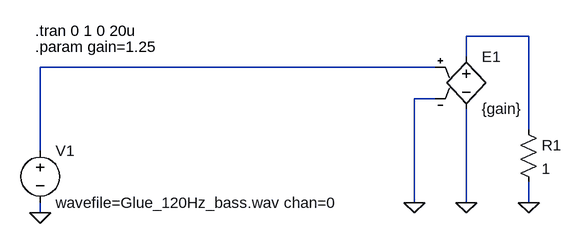
[diagram p0: schematic WaveFile_exam.asc]
WaveFile_exam.asc, the LTspice schematic file:
Version 4
SHEET 1 880 680
WIRE 736 -64 640 -64
WIRE 640 -32 640 -64
WIRE 592 -16 -16 -16
WIRE 592 32 560 32
WIRE 736 80 736 -64
WIRE -16 112 -16 -16
WIRE 560 192 560 32
WIRE 640 192 640 48
WIRE 736 192 736 160
WIRE -16 208 -16 192
FLAG -16 208 0
FLAG 560 192 0
FLAG 736 192 0
FLAG 640 192 0
SYMBOL voltage -16 96 R0
WINDOW 123 0 0 Left 0
WINDOW 39 0 0 Left 0
SYMATTR InstName V1
SYMATTR Value wavefile=Glue_120Hz_bass.wav chan=0
SYMBOL res 720 64 R0
SYMATTR InstName R1
SYMATTR Value 1
SYMBOL e 640 -48 R0
SYMATTR InstName E1
SYMATTR Value {gain}
TEXT -24 -48 Left 2 !.param gain=1.25
TEXT -24 -72 Left 2 !.tran 0 1 0 20u

The netlist it stands for:
* WaveFile_exam.asc
V1 N002 0 wavefile=Glue_120Hz_bass.wav chan=0
R1 N001 0 1
E1 N001 0 N002 0 {gain}
.param gain=1.25
.tran 0 1 0 20u
.backanno
.end